# Altium schematic sheet analog_tl494.SchDoc
size A4; SheetNumber: 12; SheetTotal: 14
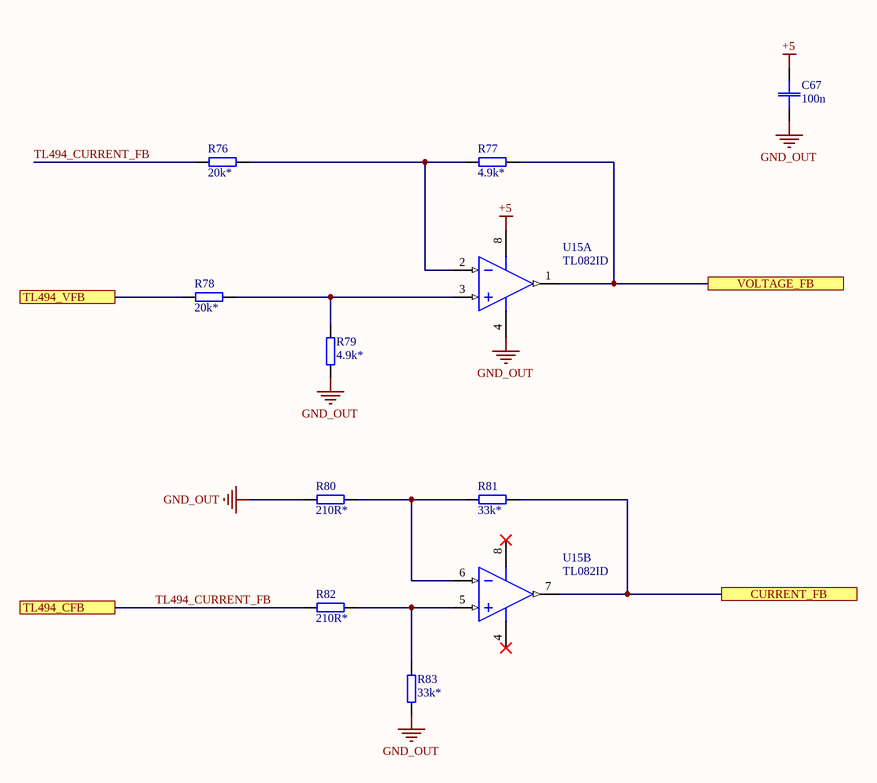
[diagram p0: analog_tl494.SchDoc]

## Parts
C67  100n  [CAP: 0603]
R76  20k*  [RES: 0603]
R77  4.9k*  [RES: 0603]
R78  20k*  [RES: 0603]
R79  4.9k*  [RES: 0603]
R80  210R*  [RES: 0603]
R81  33k*  [RES: 0603]
R82  210R*  [RES: 0603]
R83  33k*  [RES: 0603]
U15  TL082ID  [TI-D8_N]  (parts A,B of 2)

## Ports
CURRENT_FB, TL494_CFB, TL494_VFB, VOLTAGE_FB

## Nets
+5: C67.2 U15.8(VCC+)
GND_OUT: C67.1 R79.2 R80.1 R83.1 U15.4(VCC-)
CURRENT_FB: R81.2 U15.7(OUT2) ; port CURRENT_FB
TL494_CURRENT_FB: R76.1 R82.1 ; port TL494_CFB
TL494_VFB: R78.1 ; port TL494_VFB
VOLTAGE_FB: R77.2 U15.1(OUT1) ; port VOLTAGE_FB
NetR76_2: R76.2 R77.1 U15.2(IN1-)
NetR78_2: R78.2 R79.1 U15.3(IN1+)
NetR80_2: R80.2 R81.1 U15.6(IN2-)
NetR82_2: R82.2 R83.2 U15.5(IN2+)

## Library data of the parts
C67 = C_SMD: Value: 100n
R76-R83 = R_SMD
  R76 R78: Value: 20k*
  R77 R79: Value: 4.9k*
  R80 R82: Value: 210R*
  R81 R83: Value: 33k*
U15 = TL082ID: JFET-Input Operational Amplifier, 7 to 36 V, -40 to 85 degC, 8-pin SOIC (D8), Green (RoHS & no Sb/Br); Manufacturer: Texas Instruments; CMRR(Min)(dB): 75; GBW(Typ)(MHz): 3; IIB(Max)(pA): 200; Iq per channel(Max)(mA): 2.8; Number of Channels: 2; Offset Drift(Typ)(uV/C): 18; Rating: Catalog; Slew Rate(Typ)(V/us): 13; Sub Family: General Purpose Amplifier, High Supply Voltage Amplifier (>=30V); Total Supply Voltage(Max)(+5V is 5, +/-5V is 10): 36; Total Supply Voltage(Min)(+5V is 5, +/-5V is 10): 7; Vio (25C)(Max)(mV): 6; DatasheetVersion: SLOS081G; PackageVersion: 4040047-3/M, 06/2011; PackageReference: D8; PackageDescription: 8-Pin Plastic Small Outline, Body 4.9 x 3.9 mm, Pitch 1.27 mm; Supplier 1: Digi-Key; Supplier Part Number 1: 296-7209-5-ND; Supplier 2: Farnell; Supplier Part Number 2: 9593403; Supplier 3: Newark; Supplier Part Number 3: 08F9350; Supplier 4: Mouser; Supplier Part Number 4: 595-TL082ID; Eco-Plan: Green (RoHS & no Sb/Br); Vn at 1kHz(Typ)(nV/rtHz): 18; Mounting Technology: Surface Mount; Code_JEDEC: MS-012; PartNumber: TL082ID; ComponentLink1Description: Manufacturer URL; ComponentLink1URL: http://www.ti.com/; ComponentLink2Description: Datasheet; ComponentLink2URL: http://www.ti.com/lit/ds/symlink/tl082.pdf; ComponentLink3Description: Package Specification; ComponentLink3URL: http://www.ti.com/litv/pdf/msoi002j